# Altium schematic sheet Sheet2.SchDoc
size B
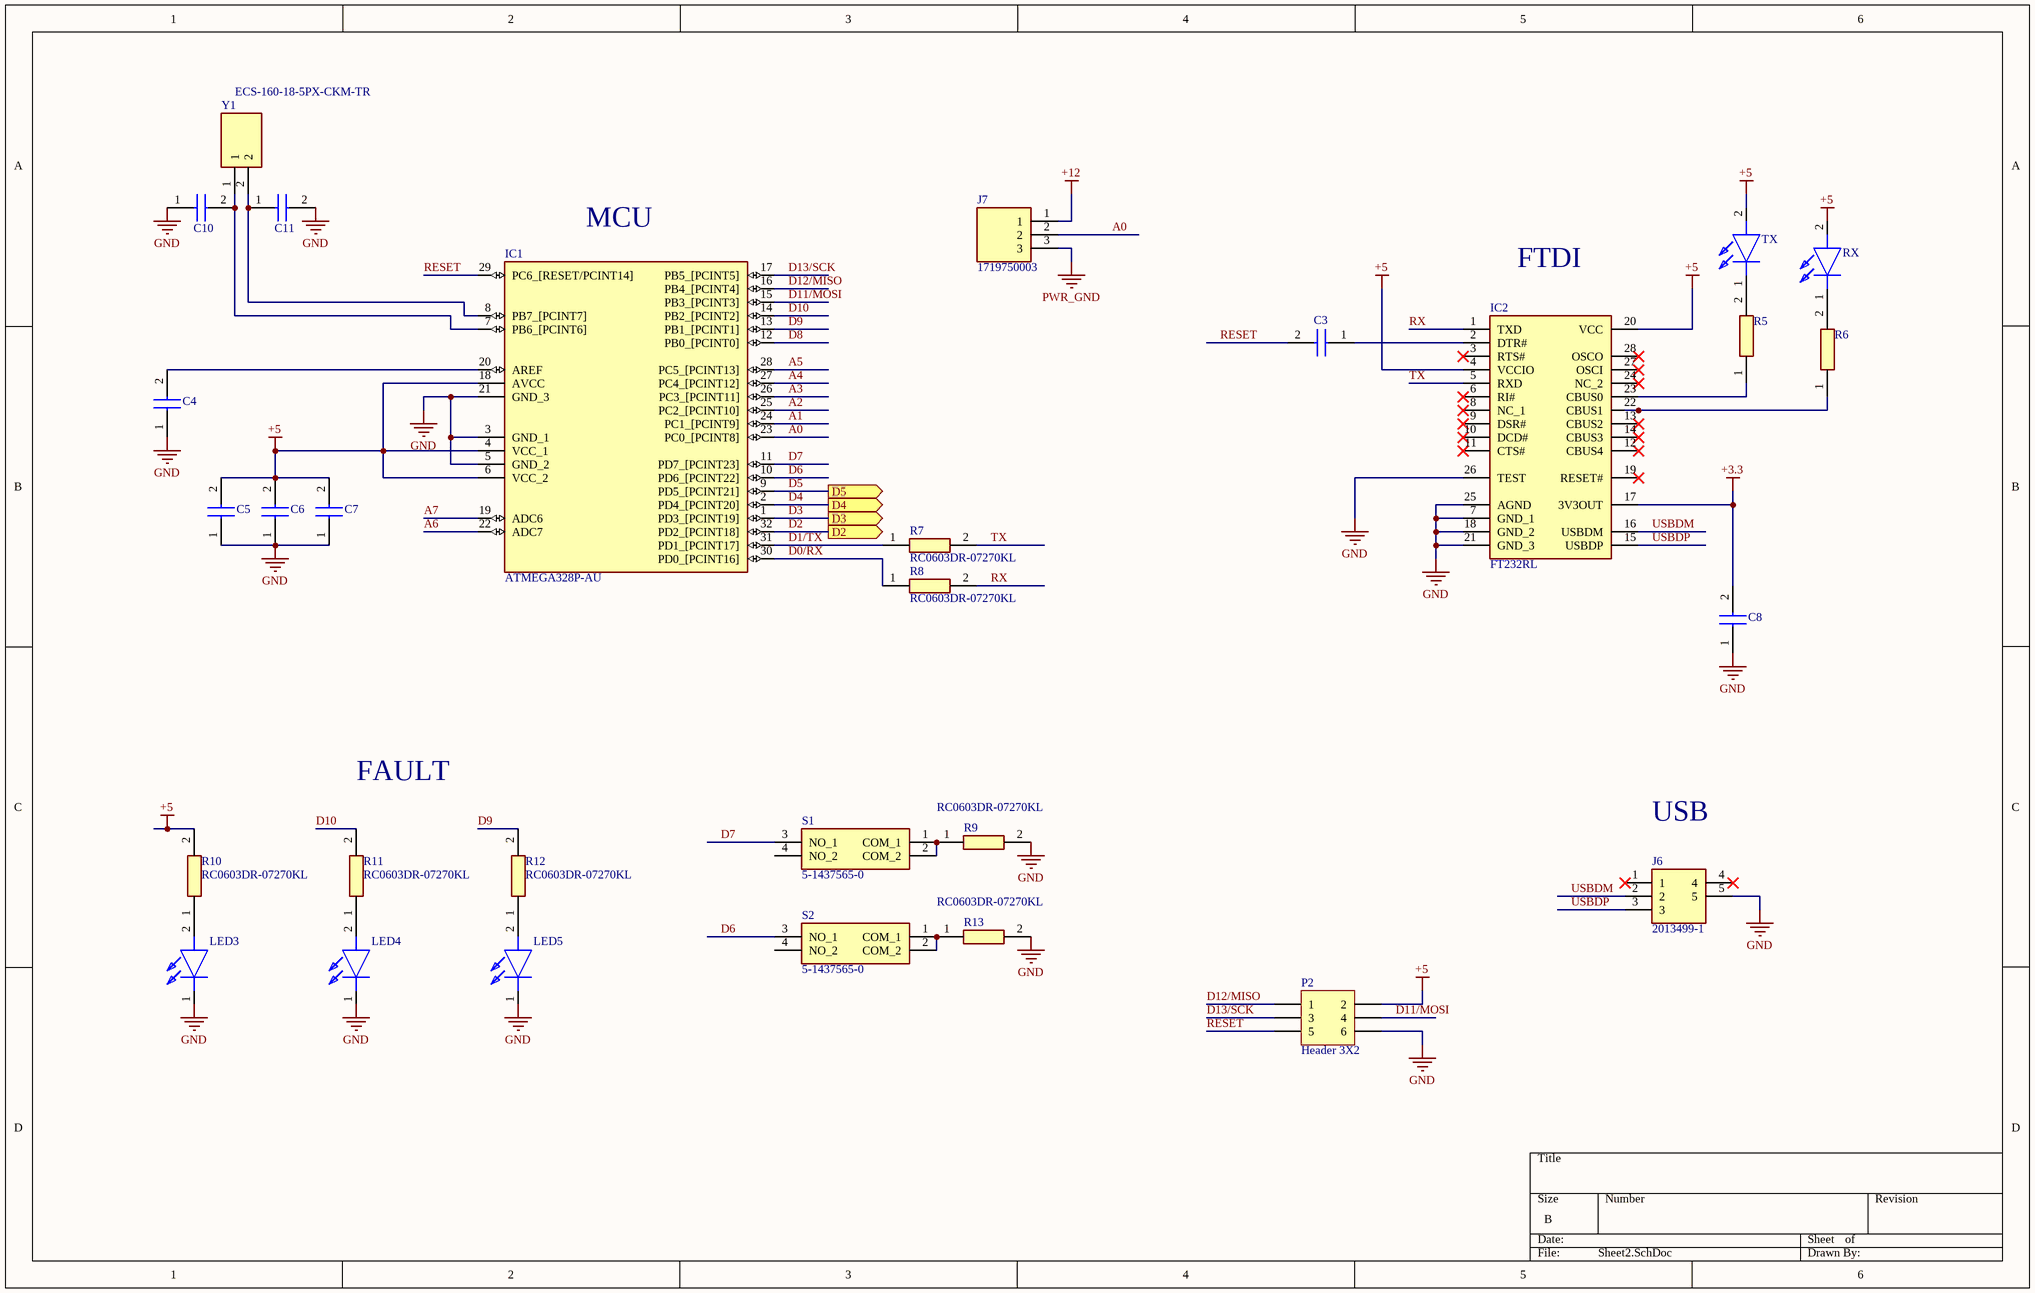
[diagram p0: Sheet2.SchDoc]

## Parts
C3  C0603C104K3RACTU  [CAPC1608X95N]  (value not drawn)
C4  C0603C104K3RACTU  [CAPC1608X95N]  (value not drawn)
C5  C0603C104K3RACTU  [CAPC1608X95N]  (value not drawn)
C6  C0603C104K3RACTU  [CAPC1608X95N]  (value not drawn)
C7  C0603C104K3RACTU  [CAPC1608X95N]  (value not drawn)
C8  C0603C104K3RACTU  [CAPC1608X95N]  (value not drawn)
C10  C0603C104K3RACTU  [CAPC1608X95N]  (value not drawn)
C11  C0603C104K3RACTU  [CAPC1608X95N]  (value not drawn)
IC1  ATMEGA328P-AU  [QFP80P900X900X120-32N]
IC2  FT232RL  [SOP65P778X200-28N]
J6  2013499-1  [2013499-1]
J7  1719750003  [171975YY03]
LED3  LTST-C191TBKT-5A  [LEDC1608X65N]  (value not drawn)
LED4  LTST-C191TBKT-5A  [LEDC1608X65N]  (value not drawn)
LED5  LTST-C191TBKT-5A  [LEDC1608X65N]  (value not drawn)
P2  Header 3X2  [HDR2X3]
R5  RC0603DR-07270KL  [RESC1608X55N]  (value not drawn)
R6  RC0603DR-07270KL  [RESC1608X55N]  (value not drawn)
R7  RC0603DR-07270KL  [RESC1608X55N]
R8  RC0603DR-07270KL  [RESC1608X55N]
R9  RC0603DR-07270KL  [RESC1608X55N]
R10  RC0603DR-07270KL  [RESC1608X55N]
R11  RC0603DR-07270KL  [RESC1608X55N]
R12  RC0603DR-07270KL  [RESC1608X55N]
R13  RC0603DR-07270KL  [RESC1608X55N]
RX  LTST-C191TBKT-5A  [LEDC1608X65N]  (value not drawn)
S1  5-1437565-0  [FSM6JSMATR]
S2  5-1437565-0  [FSM6JSMATR]
TX  LTST-C191TBKT-5A  [LEDC1608X65N]  (value not drawn)
Y1  ECS-160-18-5PX-CKM-TR  [ECS49205PXTR]

## Ports
D2 (out), D3 (out), D4 (out), D5 (out)

## Nets
+3.3: C8.2 IC2.17(3V3OUT)
+5: C5.2 C6.2 C7.2 IC1.4(VCC_1) IC1.6(VCC_2) IC1.18(AVCC) IC2.4(VCCIO) IC2.20(VCC) P2.2 R10.2 RX.2(A) TX.2(A)
+12: J7.1
GND: C4.1 C5.1 C6.1 C7.1 C8.1 C10.1 C11.2 IC1.3(GND_1) IC1.5(GND_2) IC1.21(GND_3) IC2.7(GND_1) IC2.18(GND_2) IC2.21(GND_3) IC2.25(AGND) IC2.26(TEST) J6.5 LED3.1(K) LED4.1(K) LED5.1(K) P2.6 R9.2 R13.2
PWR_GND: J7.3
A0: IC1.23(PC0_[PCINT8]) J7.2
A1: IC1.24(PC1_[PCINT9])
A2: IC1.25(PC2_[PCINT10])
A3: IC1.26(PC3_[PCINT11])
A4: IC1.27(PC4_[PCINT12])
A5: IC1.28(PC5_[PCINT13])
A6: IC1.22(ADC7)
A7: IC1.19(ADC6)
D0/RX: IC1.30(PD0_[PCINT16]) R8.1
D1/TX: IC1.31(PD1_[PCINT17]) R7.1
D2: IC1.32(PD2_[PCINT18]) ; port D2
D3: IC1.1(PD3_[PCINT19]) ; port D3
D4: IC1.2(PD4_[PCINT20]) ; port D4
D5: IC1.9(PD5_[PCINT21]) ; port D5
D6: IC1.10(PD6_[PCINT22]) S2.3(NO_1)
D7: IC1.11(PD7_[PCINT23]) S1.3(NO_1)
D8: IC1.12(PB0_[PCINT0])
D9: IC1.13(PB1_[PCINT1]) R12.2
D10: IC1.14(PB2_[PCINT2]) R11.2
D11/MOSI: IC1.15(PB3_[PCINT3]) P2.4
D12/MISO: IC1.16(PB4_[PCINT4]) P2.1
D13/SCK: IC1.17(PB5_[PCINT5]) P2.3
RESET: C3.2 IC1.29(PC6_[RESET/PCINT14]) P2.5
RX: IC2.1(TXD) R8.2
TX: IC2.5(RXD) R7.2
USBDM: IC2.16(USBDM) J6.2
USBDP: IC2.15(USBDP) J6.3
NetC3_1: C3.1 IC2.2(DTR#)
NetC4_2: C4.2 IC1.20(AREF)
NetC10_2: C10.2 IC1.7(PB6_[PCINT6]) Y1.1
NetC11_1: C11.1 IC1.8(PB7_[PCINT7]) Y1.2
NetIC2_22: IC2.22(CBUS1) R6.1
NetIC2_23: IC2.23(CBUS0) R5.1
NetLED3_2: LED3.2(A) R10.1
NetLED4_2: LED4.2(A) R11.1
NetLED5_2: LED5.2(A) R12.1
NetR5_2: R5.2 TX.1(K)
NetR6_2: R6.2 RX.1(K)
NetR9_1: R9.1 S1.1(COM_1) S1.2(COM_2)
NetR13_1: R13.1 S2.1(COM_1) S2.2(COM_2)

Not connected (* = marked no-connect by the designer): IC2 3(RTS#)* 6(RI#)* 8(NC_1)* 9(DSR#)* 10(DCD#)* 11(CTS#)* 12(CBUS4)* 13(CBUS2)* 14(CBUS3)* 19(RESET#)* 24(NC_2)* 27(OSCI)* 28(OSCO)*; J6 1* 4*; S1 4(NO_2); S2 4(NO_2)

## Notes on the sheet
- (near IC1) MCU
- FTDI
- FAULT
- USB

## Library data of the parts
C3-C8 = C0603C104K3RACTU: Capacitor; Manufacturer_Name: Kemet; Datasheet Link: https://content.kemet.com/datasheets/KEM_C1002_X7R_SMD.pdf; Height: 0.95mm; Manufacturer_Part_Number: C0603C104K3RACTU; Mouser Part Number: 80-C0603C104K3R; Mouser Price/Stock: https://www.mouser.co.uk/ProductDetail/KEMET/C0603C104K3RACTU/?qs=l5k%252BbMnNDklvfdneglCDAg%3D%3D; Arrow Part Number: C0603C104K3RACTU; Arrow Price/Stock: https://www.arrow.com/en/products/c0603c104k3ractu/kemet-corporation
C10 C11 = 06035A200KAT2A: Capacitor 20pf; Manufacturer_Name: Kemet; Datasheet Link: https://content.kemet.com/datasheets/KEM_C1002_X7R_SMD.pdf; Height: 0.95mm; Manufacturer_Part_Number: C0603C104K3RACTU; Mouser Part Number: 80-C0603C104K3R; Mouser Price/Stock: https://www.mouser.co.uk/ProductDetail/KEMET/C0603C104K3RACTU/?qs=l5k%252BbMnNDklvfdneglCDAg%3D%3D; Arrow Part Number: C0603C104K3RACTU; Arrow Price/Stock: https://www.arrow.com/en/products/c0603c104k3ractu/kemet-corporation
IC1 = ATMEGA328P-AU: Integrated Circuit; Manufacturer_Name: Microchip; Datasheet Link: https://componentsearchengine.com/Datasheets/2/ATMEGA328P-AU.pdf; Height: 1.2mm; Manufacturer_Part_Number: ATMEGA328P-AU; Mouser Part Number: 556-ATMEGA328P-AU; Mouser Price/Stock: https://www.mouser.co.uk/ProductDetail/Microchip-Technology-Atmel/ATMEGA328P-AU?qs=K8BHR703ZXiCmmgp6%2FGNmQ%3D%3D; Arrow Part Number: ATMEGA328P-AU; Arrow Price/Stock: https://www.arrow.com/en/products/atmega328p-au/microchip-technology
IC2 = FT232RL: Integrated Circuit; Manufacturer_Name: FTDI Chip; Datasheet Link: http://www.ftdichip.com/Support/Documents/DataSheets/ICs/DS_FT232R.pdf; Height: 2mm; Manufacturer_Part_Number: FT232RL; Arrow Part Number: FT232RL; Arrow Price/Stock: https://www.arrow.com/en/products/ft232rl/ftdi-chip
J6 = 2013499-1: Connector; Manufacturer_Name: TE Connectivity; Datasheet Link: http://www.te.com/commerce/DocumentDelivery/DDEController?Action=showdoc&DocId=Customer+Drawing%7F2013499%7FB2%7Fpdf%7FEnglish%7FENG_CD_2013499_B2.pdf%7F2013499-1; Manufacturer_Part_Number: 2013499-1; Mouser Part Number: 571-2013499-1; Mouser Price/Stock: https://www.mouser.co.uk/ProductDetail/TE-Connectivity/2013499-1/?qs=TL6PIybY3BOLK37GbUYdng%3D%3D; Arrow Part Number: 2013499-1; Arrow Price/Stock: https://www.arrow.com/en/products/2013499-1/te-connectivity
J7 = 1719750003: Connector; Manufacturer_Name: Molex; Datasheet Link: https://www.molex.com/pdm_docs/sd/1719750002_sd.pdf; Height: 7mm; Manufacturer_Part_Number: 1719750003
LED3-LED5 RX TX = LTST-C191TBKT-5A: LED; Manufacturer_Name: Lite-On; Datasheet Link: http://www.mouser.com/ds/2/239/S_110_LTST-C191TBKT-5A-336399.pdf; Height: 0.65mm; Manufacturer_Part_Number: LTST-C191TBKT-5A; Mouser Part Number: 859-LTST-C191TBKT-5A; Mouser Price/Stock: https://www.mouser.co.uk/ProductDetail/Lite-On/LTST-C191TBKT-5A/?qs=xb8aMrBSZRLgwF8AXHEbeQ%3D%3D; Arrow Part Number: LTST-C191TBKT-5A; Arrow Price/Stock: https://www.arrow.com/en/products/ltst-c191tbkt-5a/lite-on-technology
P2 = Header 3X2: Header, 3-Pin, Dual row; LatestRevisionDate: 17-Jul-2002; LatestRevisionNote: Re-released for DXP Platform.; Publisher: Altium Limited
R5-R13 = RC0603DR-07270KL: Resistor; Manufacturer_Name: YAGEO (PHYCOMP); Datasheet Link: http://www.yageo.com/documents/recent/PYu-RC0603_51_RoHS_L_v5.pdf; Height: 0.55mm; Manufacturer_Part_Number: RC0603DR-07270KL; Arrow Part Number: RC0603DR-07270KL; Arrow Price/Stock: https://www.arrow.com/en/products/rc0603dr-07270kl/yageo
S1 S2 = 5-1437565-0: Switch; Manufacturer_Name: TE Connectivity; Datasheet Link: https://www.te.com/commerce/DocumentDelivery/DDEController?Action=showdoc&DocId=Customer+Drawing%7F2-1437565-7%7FV%7Fpdf%7FEnglish%7FENG_CD_2-1437565-7_V.pdf%7F5-1437565-0; Height: 7.26mm; Manufacturer_Part_Number: 5-1437565-0; Mouser Part Number: 506-5-1437565-0; Mouser Price/Stock: https://www.mouser.co.uk/ProductDetail/TE-Connectivity-PB/5-1437565-0?qs=%2FwXgF%2FfIho9mO1nArmyR6A%3D%3D
Y1 = ECS-160-18-5PX-CKM-TR: Crystal or Oscillator; Manufacturer_Name: ECS; Datasheet Link: https://ecsxtal.com/store/pdf/csm-7x.pdf; Height: 4.3mm; Manufacturer_Part_Number: ECS-160-18-5PX-CKM-TR